# EAGLE design OpenQuadcopter (EAGLE 7.5.0)
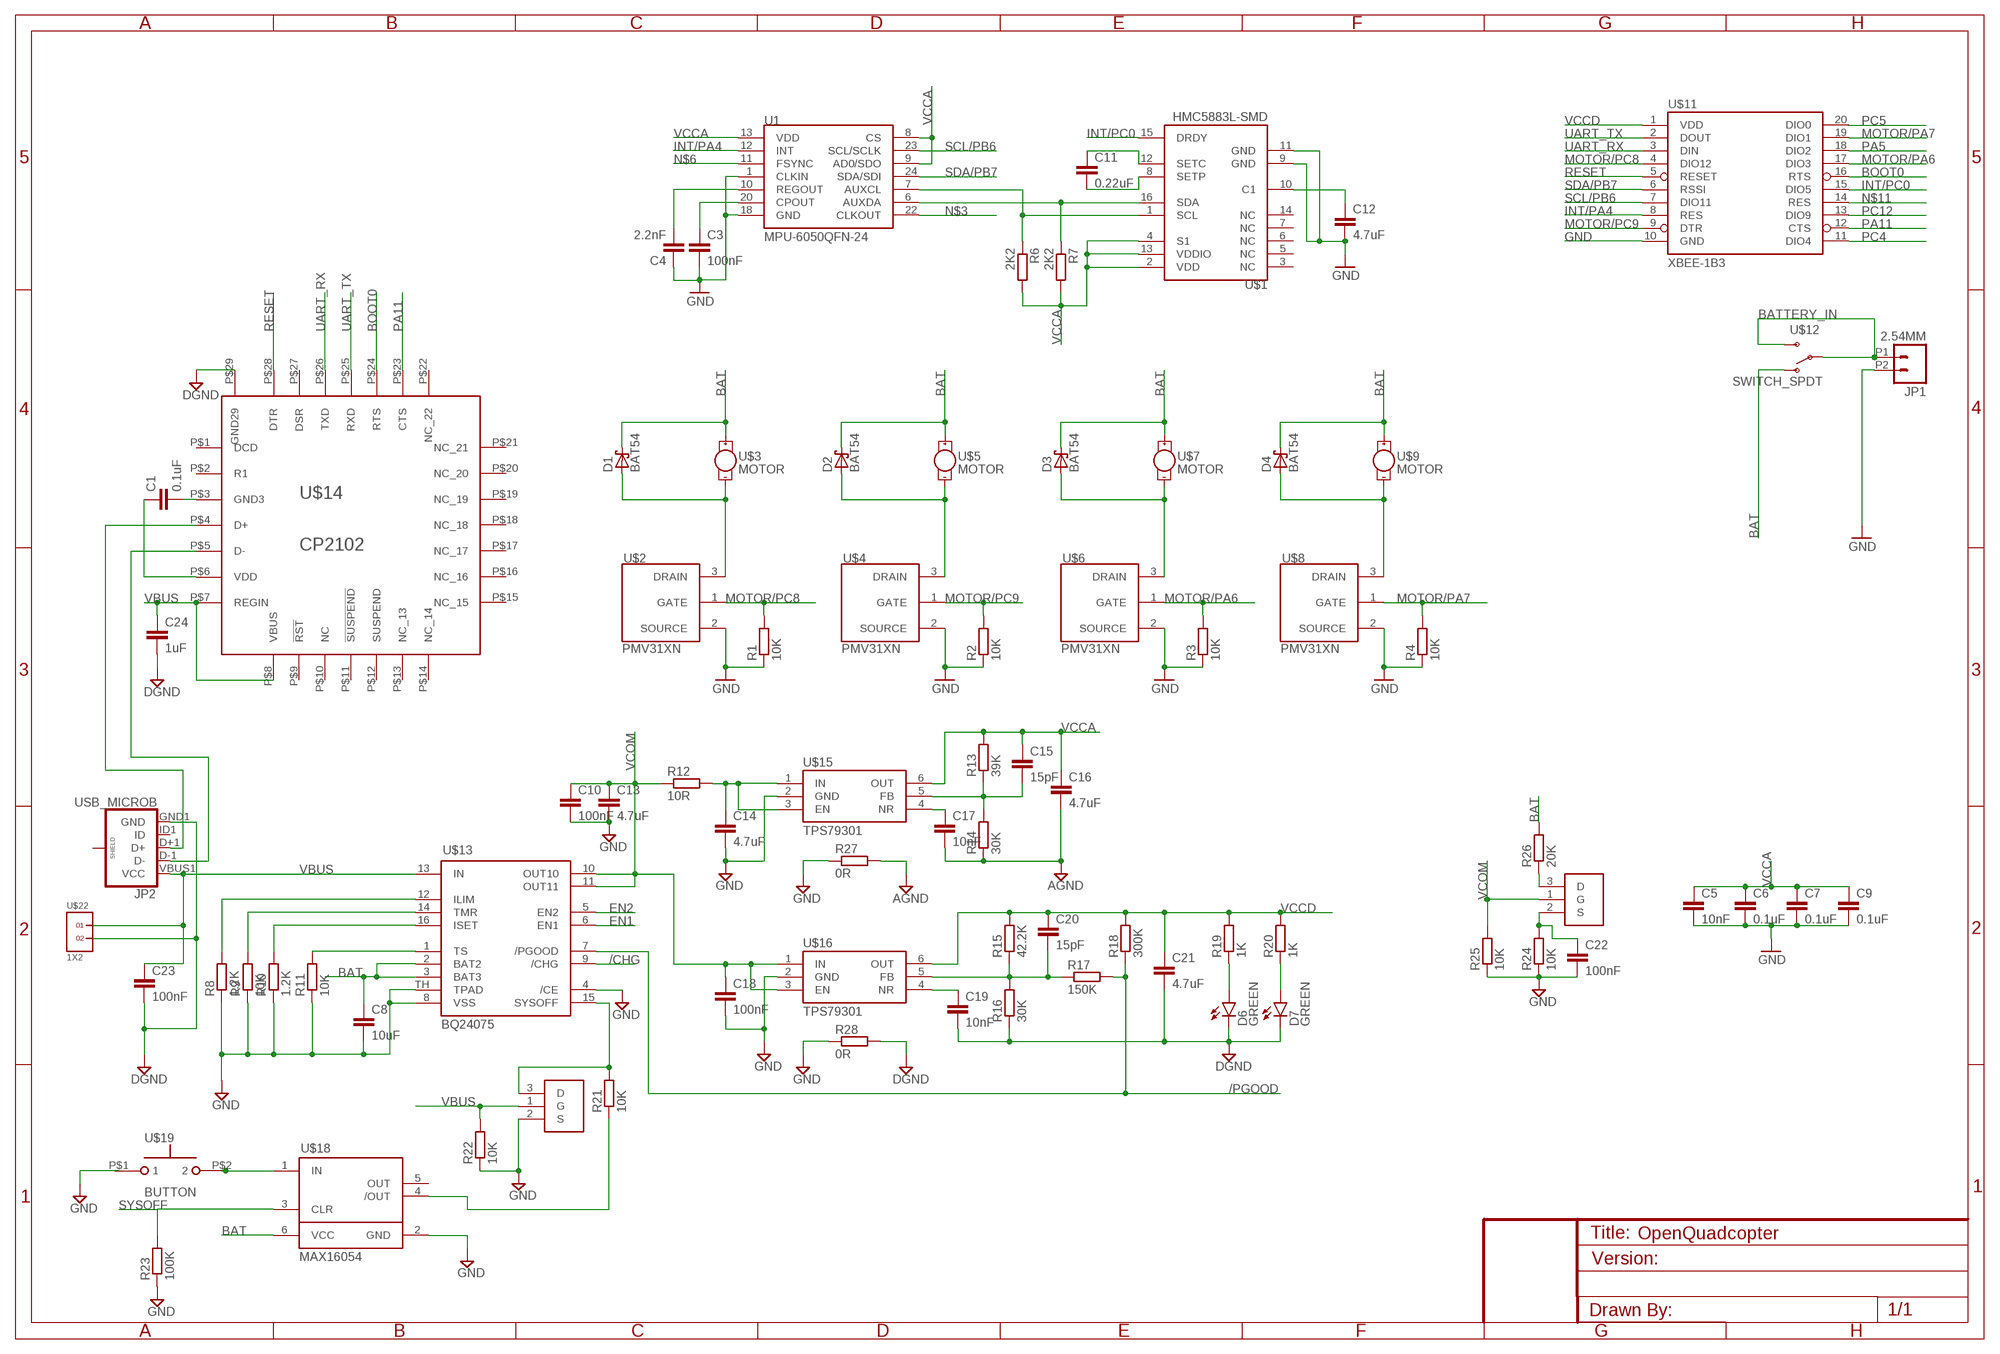
[diagram p0: schematic, sheet 1]

## Parts
C1  0.1uF  C-EUC0402  [C0402]
C3  100nF  C-EUC0402  [C0402]
C4  2.2nF  C-EUC0402  [C0402]
C5  10nF  C-EUC0402  [C0402]
C6  0.1uF  C-EUC0402  [C0402]
C7  0.1uF  C-EUC0402  [C0402]
C8  10uF  C-EUC0603  [C0603]
C9  0.1uF  C-EUC0402  [C0402]
C10  100nF  C-EUC0402  [C0402]
C11  0.22uF  C-EUC0402  [C0402]
C12  4.7uF  C-EUC0603  [C0603]
C13  4.7uF  C-EUC0603  [C0603]
C14  4.7uF  C-EUC0603  [C0603]
C15  15pF  C-EUC0402  [C0402]
C16  4.7uF  C-EUC0603  [C0603]
C17  10nF  C-EUC0402  [C0402]
C18  100nF  C-EUC0402  [C0402]
C19  10nF  C-EUC0402  [C0402]
C20  15pF  C-EUC0402  [C0402]
C21  4.7uF  C-EUC0603  [C0603]
C22  100nF  C-EUC0402  [C0402]
C23  100nF  C-EUC0402  [C0402]
C24  1uF  C-EUC0603  [C0603]
D1  BAT54  [SOT23]
D2  BAT54  [SOT23]
D3  BAT54  [SOT23]
D4  BAT54  [SOT23]
D6  GREEN  LED-GREEN0603  [LED-0603]
D7  GREEN  LED-GREEN0603  [LED-0603]
JP1  2.54MM  M022.54MM_SCREWTERM  [1X02_2.54_SCREWTERM]
JP2  USB_MICROB  USB_MICROB_PLUGCONN-11752  [USB-B-MICRO-SMD_V03]
R1  10K  R-EU_R0402  [R0402]
R2  10K  R-EU_R0402  [R0402]
R3  10K  R-EU_R0402  [R0402]
R4  10K  R-EU_R0402  [R0402]
R6  2K2  R-EU_R0402  [R0402]
R7  2K2  R-EU_R0402  [R0402]
R8  1.2K  R-EU_R0402  [R0402]
R9  10K  R-EU_R0402  [R0402]
R10  1.2K  R-EU_R0402  [R0402]
R11  10K  R-EU_R0402  [R0402]
R12  10R  R-EU_R0402  [R0402]
R13  39K  R-EU_R0402  [R0402]
R14  30K  R-EU_R0402  [R0402]
R15  42.2K  R-EU_R0402  [R0402]
R16  30K  R-EU_R0402  [R0402]
R17  150K  R-EU_R0402  [R0402]
R18  300K  R-EU_R0402  [R0402]
R19  1K  R-EU_R0402  [R0402]
R20  1K  R-EU_R0402  [R0402]
R21  10K  R-EU_R0402  [R0402]
R22  10K  R-EU_R0402  [R0402]
R23  100K  R-EU_R0402  [R0402]
R24  10K  R-EU_R0402  [R0402]
R25  10K  R-EU_R0402  [R0402]
R26  20K  R-EU_R0402  [R0402]
R27  0R  R-EU_R0402  [R0402]
R28  0R  R-EU_R0402  [R0402]
U1  MPU-6050QFN-24  MPU-6000QFN-24  [QFN-24-TESTING]
U$1  HMC5883L-SMD  HMC5883LSMD  [16LPCC]
U$2  PMV31XN  MOSFET  [SOT23-W]
U$3  MOTOR  MOTOR10MM  [VIBE-MOTOR-10MM]
U$4  PMV31XN  MOSFET  [SOT23-W]
U$5  MOTOR  MOTOR10MM  [VIBE-MOTOR-10MM]
U$6  PMV31XN  MOSFET  [SOT23-W]
U$7  MOTOR  MOTOR10MM  [VIBE-MOTOR-10MM]
U$8  PMV31XN  MOSFET  [SOT23-W]
U$9  MOTOR  MOTOR10MM  [VIBE-MOTOR-10MM]
U$11  XBEE-1B3  [XBEE-SMD]
U$12  SWITCH_SPDT  [KPS-1290]
U$13  BQ24075  [QFN16]
U$14  CP2102  [QFN28-5X5]
U$15  TPS79301  [SOT23-6]
U$16  TPS79301  [SOT23-6]
U$17  2N7002  [SOT23-3]
U$18  MAX16054  [SOT23-6]
U$19  BUTTON  [BUTTON]
U$20  2N7002  [SOT23-3]
U$22  1X2  [1X2]

## Nets
/CHG: U$13.9(/CHG)
/PGOOD: R17.2 R18.1 U$13.7(/PGOOD)
AGND: C16.2 C17.2 R14.1 R27.2
BAT: C8.1 D1.3(C) D2.3(C) D3.3(C) D4.3(C) R26.2 U$3.+ U$5.+ U$7.+ U$9.+ U$12.O U$13.2(BAT2) U$13.3(BAT3) U$18.6(VCC)
BATTERY_IN: JP1.P1 U$12.P U$12.S
BOOT0: U$11.16(RTS) U$14.P$24(RTS)
DGND: C19.2 C21.2 C23.2 C24.2 D6.C D7.C JP2.GND1(GND) R16.1 R28.2 U$14.P$29(GND29) U$22.2
EN1: U$13.6(EN1)
EN2: U$13.5(EN2)
GND: C3.2 C4.1 C5.2 C6.2 C7.2 C8.2 C9.2 C10.2 C12.2 C13.2 C14.2 C18.2 C22.2 JP1.P2 R1.1 R2.1 R3.1 R4.1 R8.1 R9.1 R10.1 R11.1 R22.1 R23.1 R24.1 R25.1 R27.1 R28.1 U1.1(CLKIN) U1.18(GND) U$1.9(GND) U$1.11(GND) U$2.2(SOURCE) U$4.2(SOURCE) U$6.2(SOURCE) U$8.2(SOURCE) U$11.10(GND) U$13.4(/CE) U$13.8(VSS) U$13.TH(TPAD) U$15.2(GND) U$16.2(GND) U$17.2(S) U$18.2(GND)
INT/PA4: U1.12(INT) U$11.8(RES)
INT/PC0: U$1.15(DRDY) U$11.15(DIO5)
MOTOR/PA6: R3.2 U$6.1(GATE) U$11.17(DIO3)
MOTOR/PA7: R4.2 U$8.1(GATE) U$11.19(DIO1)
MOTOR/PC8: R1.2 U$2.1(GATE) U$11.4(DIO12)
MOTOR/PC9: R2.2 U$4.1(GATE) U$11.9(DTR)
N$1: D2.1(A) U$4.3(DRAIN) U$5.-
N$2: D1.1(A) U$2.3(DRAIN) U$3.-
N$3: U1.22(CLKOUT)
N$4: R6.1 U1.7(AUXCL) U$1.1(SCL)
N$5: D3.1(A) U$6.3(DRAIN) U$7.-
N$6: U1.11(FSYNC)
N$7: D4.1(A) U$8.3(DRAIN) U$9.-
N$8: R7.1 U1.6(AUXDA) U$1.16(SDA)
N$9: C4.2 U1.10(REGOUT)
N$10: C1.2 U$14.P$3(GND3)
N$11: U$11.14(RES)
N$12: C3.1 U1.20(CPOUT)
N$13: C11.1 U$1.12(SETC)
N$14: C11.2 U$1.8(SETP)
N$15: R21.1 U$18.4(/OUT)
N$16: C12.1 U$1.10(C1)
N$17: C1.1 U$14.P$6(VDD)
N$18: R8.2 U$13.12(ILIM)
N$19: R9.2 U$13.14(TMR)
N$20: R10.2 U$13.16(ISET)
N$21: R11.2 U$13.1(TS)
N$23: R21.2 U$13.15(SYSOFF) U$17.3(D)
N$24: C14.1 R12.2 U$15.1(IN) U$15.3(EN)
N$25: U$18.1(IN) U$19.P$2
N$26: C15.2 R13.1 R14.2 U$15.5(FB)
N$27: C17.1 U$15.4(NR)
N$28: C19.1 U$16.4(NR)
N$29: C20.2 R15.1 R16.2 R17.1 U$16.5(FB)
N$30: C22.1 R24.2 U$20.2(S)
N$32: D6.A R19.1
N$33: D7.A R20.1
N$34: R26.1 U$20.3(D)
N$35: JP2.D+1(D+) U$14.P$4(D+)
N$36: JP2.D-1(D-) U$14.P$5(D-)
PA5: U$11.18(DIO2)
PA11: U$11.12(CTS) U$14.P$23(CTS)
PC4: U$11.11(DIO4)
PC5: U$11.20(DIO0)
PC12: U$11.13(DIO9)
RESET: U$11.5(RESET) U$14.P$28(DTR)
SCL/PB6: U1.23(SCL/SCLK) U$11.7(DIO11)
SDA/PB7: U1.24(SDA/SDI) U$11.6(RSSI)
SYSOFF: R23.2 U$18.3(CLR)
UART_RX: U$11.3(DIN) U$14.P$26(TXD)
UART_TX: U$11.2(DOUT) U$14.P$25(RXD)
VBUS: C23.1 C24.1 JP2.VBUS1(VCC) R22.2 U$13.13(IN) U$14.P$7(REGIN) U$14.P$8(VBUS) U$17.1(G) U$22.1
VCCA: C5.1 C6.1 C7.1 C9.1 C15.1 C16.1 R6.2 R7.2 R13.2 U1.8(CS) U1.9(AD0/SDO) U1.13(VDD) U$1.2(VDD) U$1.4(S1) U$1.13(VDDIO) U$15.6(OUT)
VCCD: C20.1 C21.1 R15.2 R18.2 R19.2 R20.2 U$11.1(VDD) U$16.6(OUT)
VCOM: C10.1 C13.1 C18.1 R12.1 R25.2 U$13.10(OUT10) U$13.11(OUT11) U$16.1(IN) U$16.3(EN) U$20.1(G)
Unconnected: JP2.ID1(ID) JP2.SHIELD1(SHIELD) JP2.SHIELD2(SHIELD) JP2.SHIELD3(SHIELD) U$1.3(NC) U$1.5(NC) U$1.6(NC) U$1.7(NC) U$1.14(NC) U$14.P$1(DCD) U$14.P$2(R1) U$14.P$9(!RST) U$14.P$10(NC) U$14.P$11(!SUSPEND) U$14.P$12(SUSPEND) U$14.P$13(NC_13) U$14.P$14(NC_14) U$14.P$15(NC_15) U$14.P$16(NC_16) U$14.P$17(NC_17) U$14.P$18(NC_18) U$14.P$19(NC_19) U$14.P$20(NC_20) U$14.P$21(NC_21) U$14.P$22(NC_22) U$14.P$27(DSR) U$18.5(OUT) U$19.P$1

## Library data of the parts
C1 C8 C10 C13-C24 = openmotestm:C-EU: CAPACITOR, European symbol
C3-C7 C9 C11 C12 = rcl:C-EU: CAPACITOR, European symbol
D1-D4 = diode:BAT54: Schottky Diodes Source: Fairchild .. BAT54.pdf
D6 D7 = openmotestm:LED-GREEN: Various green LEDs Green LEDs used in SFE Production 0603- DIO-00821 LARGE- DIO-00862 LILYPAD- DIO-09910; PROD_ID: DIO-00821
JP1 = SparkFun-Connectors:M02: Standard 2-pin 0.1" header. Use with - straight break away headers ( PRT-00116) - right angle break away headers (PRT-00553) - swiss pins (PRT-00743) - machine pins (PRT-00117) - female headers (PRT-00115) Molex polarized connector foot print use with: PRT-08233 with associated crimp pins and housings. 2.54_SCREWTERM for use with PRT-10571. 3.5mm Screw Terminal footprints for PRT-08084 5mm Screw Terminal footprints for use with PRT-08432
JP2 = openmotestm:USB_MICROB_PLUG: USB Micro-B connectors Some male, some female. Watch your step!; PROD_ID: CONN-11752
R1-R4 R6 R7 = rcl:R-EU_: RESISTOR, European symbol
R8-R28 = openmotestm:R-EU_: RESISTOR, European symbol
U1 = openmotestm:MPU-6000: MPU-6000/6050 - I2C address is 0x68 with AD0 low and 0x69 with AD0 high.
U$1 = openmotestm:HMC5883L: 3 Axis Digital Compass IC
U$2 U$4 U$6 U$8 = openmotestm:MOSFET
U$3 U$5 U$7 U$9 = openmotestm:MOTOR: Vibration Motor- ROB-08449 Physical dimension and wire connections for this powerful vibration motor. Motor has a self adhesive backing.
U$11 = openmotestm:XBEE-1: Xbee module footprints SMT header is CONN-09042.; PROD_ID: CONN-09042
U$12 = openmotestm:SWITCH_SPDT: SWCH-10651 Side-actuated SPDT slide switch, as used on the Arduino Pro; PROD_ID: SWCH-10651
U$13 = openmotestm:BQ24075
U$14 = openmotestm:CP2102: silicon lab cp2102 signal chip usb to uart bridge
U$15 U$16 = openmotestm:TPS79301
U$17 U$20 = openmotestm:2N7002
U$18 = openmotestm:MAX16054
U$19 = openmotestm:BUTTON: TL1015AF160QG http://spec_sheets.e-switch.com/specs/P420000.pdf
U$22 = openmotestm:1X2

## Board
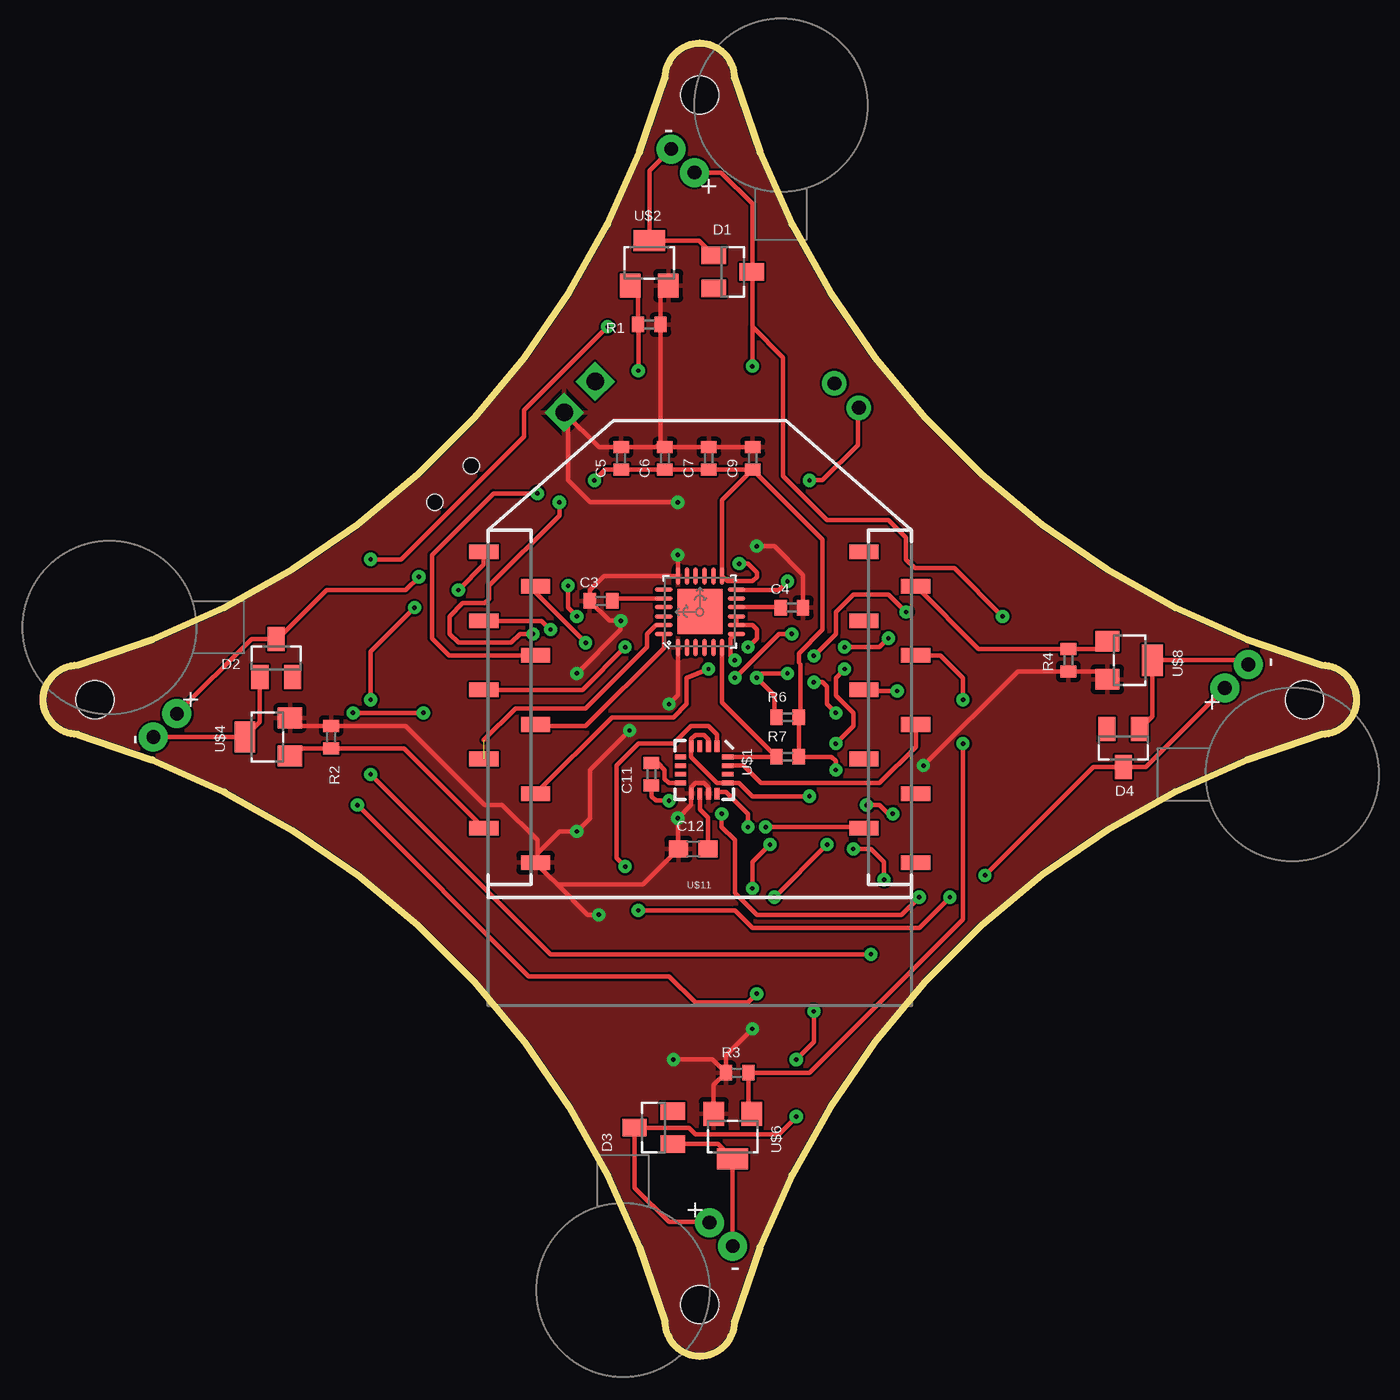
[diagram p1: board, top side]
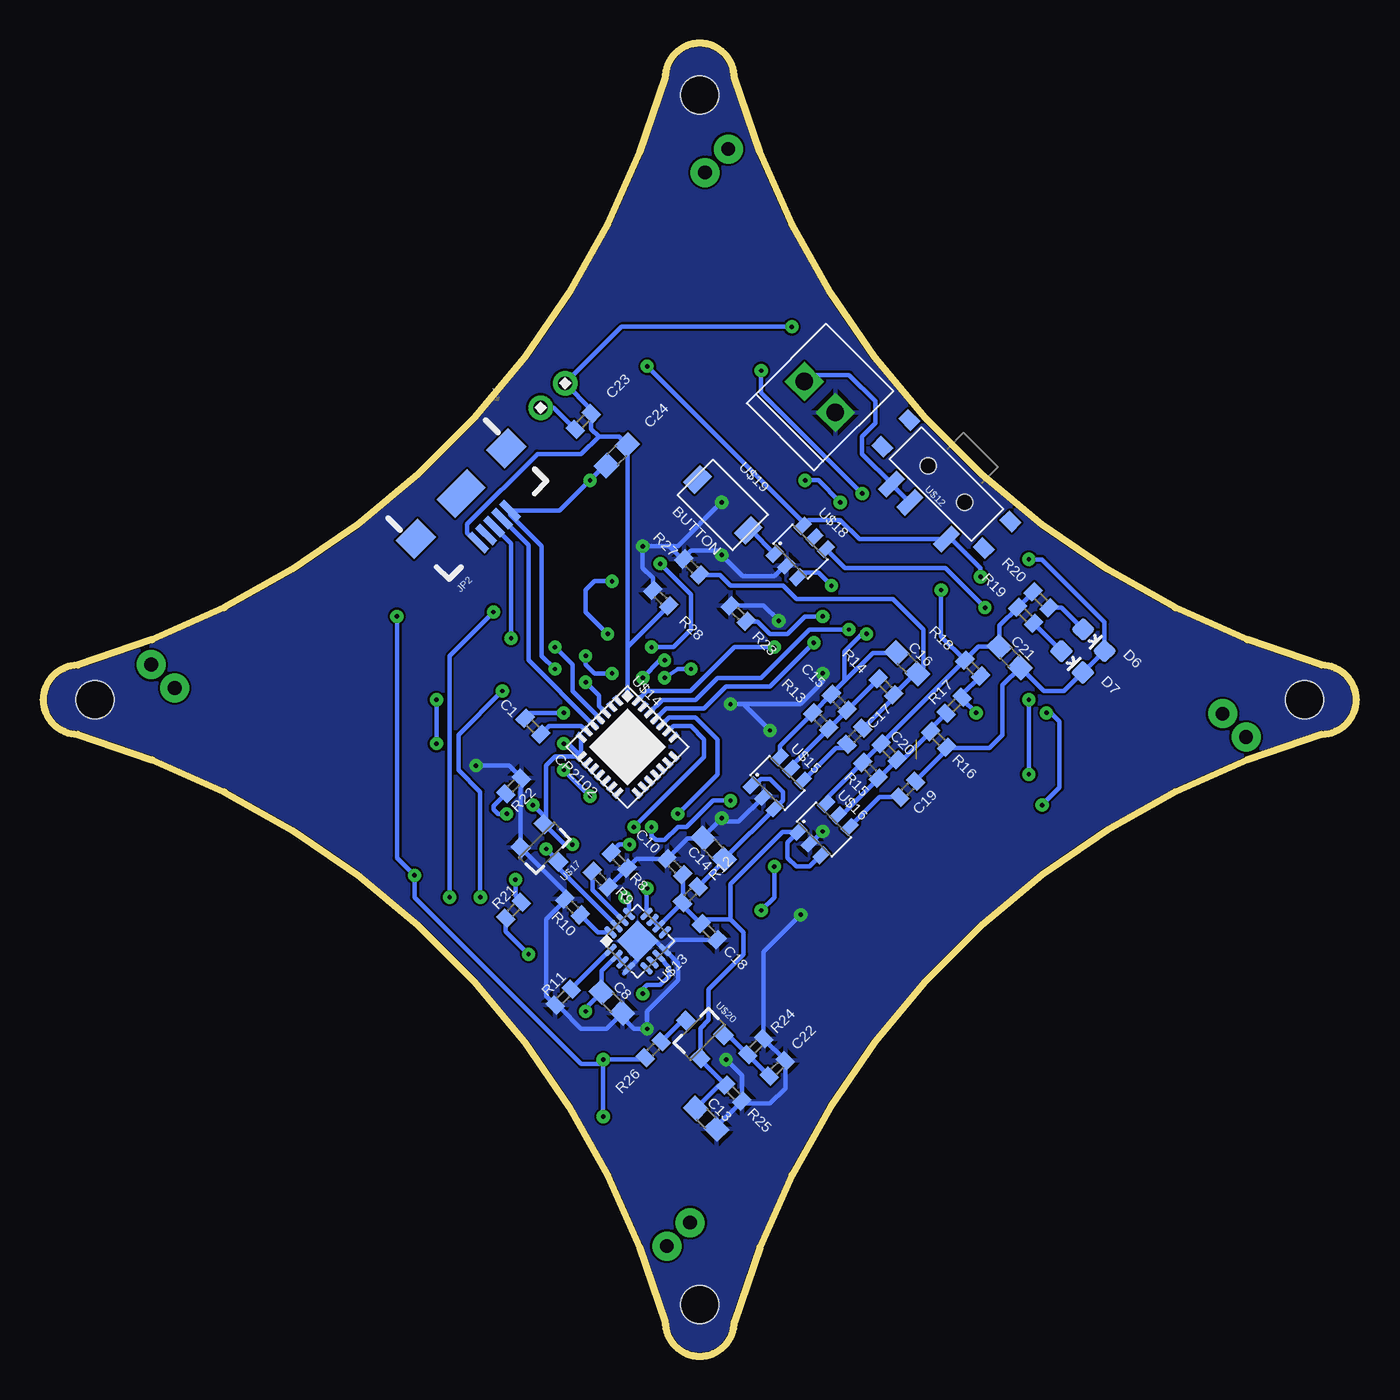
[diagram p2: board, bottom side, seen from below]

Size 76 x 76 mm. Coordinates in mm from the lower left corner, seen from the top.
Outline: 2,36 arc-57 36,2 arc180 40,2 arc-57 74,36 arc180 74,40 arc-57 40,74 arc180 36,74 arc-57 2,40 arc180 2,36
Copper layers (1*16): Top 0.035mm / dielectric 1.5mm / Bottom 0.035mm
Design rules "SparkFun *": minimum track width 8mil, minimum drill 10mil, track to track 5mil, track to pad 5mil, pad to pad 5mil, via to via 5mil, smd to smd 5mil, copper to edge 1mil, drill to drill 8mil, minimum pad ring 12mil, minimum via ring 10mil, stop-mask expansion 4mil, vias tented up to drill 20mil, thermal gap 10mil
Holes 2.2 mm at 38,73 3,38 38,3 73,38

### Footprints (pad centres in the part's own frame; a part is rotated, then mirrored left to right if it is on the bottom)
C0402 = smd 0.7 x 0.9: 1 -0.65,0; 2 0.65,0
C0603 = smd 1.1 x 1: 1 -0.85,0; 2 0.85,0
SOT23 = smd 1 x 1.4: 1 -0.95,-1.1; 2 0.95,-1.1; 3 0,1.1
LED-0603 = smd 1 x 1: A 0,-0.877; C 0,0.877
1X02_2.54_SCREWTERM = drill 1.016 square: P1 2.54,0; P2 0,0
USB-B-MICRO-SMD_V03 = smd 1.4 x 0.4: D+1 2.7,0; D-1 2.7,0.65; GND1 2.7,-1.3; ID1 2.7,-0.65; VBUS1 2.7,1.3 | smd 1.5 x 1.8: SHIELD1 0,3.7; SHIELD2 0,-3.7 | smd 1.5 x 2.5: SHIELD3 0,0
R0402 = smd 0.7 x 0.9: 1 -0.65,0; 2 0.65,0
QFN-24-TESTING = smd 1.016 x 0.254: 1 -2.066,1.257; 2 -2.066,0.75; 3 -2.066,0.247; 4 -2.066,-0.287; 5 -2.066,-0.792; 6 -2.066,-1.297; 13 2.086,-1.297; 14 2.086,-0.792; 15 2.086,-0.287; 16 2.086,0.247; 17 2.086,0.75; 18 2.086,1.257 | smd 0.254 x 1.016: 7 -1.267,-2.122; 8 -0.762,-2.122; 9 -0.258,-2.122; 10 0.278,-2.122; 11 0.78,-2.122; 12 1.287,-2.122; 19 1.287,2.082; 20 0.78,2.082; 21 0.278,2.082; 22 -0.258,2.082; 23 -0.762,2.082; 24 -1.267,2.082 | smd 2.616 x 2.616: P$1 0.02,-0.01
16LPCC = smd 0.65 x 0.28: 1 -1.37,0.75; 2 -1.37,0.25; 3 -1.37,-0.25; 4 -1.37,-0.75; 9 1.37,-0.75; 10 1.37,-0.25; 11 1.37,0.25; 12 1.37,0.75 | smd 0.28 x 0.65: 5 -0.75,-1.37; 6 -0.25,-1.37; 7 0.25,-1.37; 8 0.75,-1.37; 13 0.75,1.37; 14 0.25,1.37; 15 -0.25,1.37; 16 -0.75,1.37
SOT23-W = smd 1.2 x 1.4: 1 -1.1,-1.3; 2 1.1,-1.3 | smd 1.8 x 1.2: 3 0,1.3
VIBE-MOTOR-10MM = drill 0.8 pad 1.676: + -5,-3.9; - -6.35,-2.54
XBEE-SMD = smd 1.7 x 0.85: 1 -12.5,20; 2 -9.5,18; 3 -12.5,16; 4 -9.5,14; 5 -12.5,12; 6 -9.5,10; 7 -12.5,8; 8 -9.5,6; 9 -12.5,4; 10 -9.5,2; 11 12.5,2; 12 9.5,4; 13 12.5,6; 14 9.5,8; 15 12.5,10; 16 9.5,12; 17 12.5,14; 18 9.5,16; 19 12.5,18; 20 9.5,20
KPS-1290 = smd 0.7 x 1.5: O -2.25,2.25; P 0.75,2.25; S 2.25,2.25 | smd 1 x 0.8: P$1 -4.15,1.1; P$2 -4.15,-1.1; P$3 4.15,-1.1; P$4 4.15,1.1 | hole 0.9: -1.5,0; 1.5,0
QFN16 = smd 0.85 x 0.3: 1 -1.475,0.75; 2 -1.475,0.25; 3 -1.475,-0.25; 4 -1.475,-0.75; 9 1.475,-0.75; 10 1.475,-0.25; 11 1.475,0.25; 12 1.475,0.75 | smd 0.3 x 0.85: 5 -0.75,-1.475; 6 -0.25,-1.475; 7 0.25,-1.475; 8 0.75,-1.475; 13 0.75,1.475; 14 0.25,1.475; 15 -0.25,1.475; 16 -0.75,1.475 | smd 1.7 x 1.7: TH 0,0
QFN28-5X5 = smd 0.6 x 0.3: P$1 -2.3,1.5; P$2 -2.3,1; P$3 -2.3,0.5; P$4 -2.3,0; P$5 -2.3,-0.5; P$6 -2.3,-1; P$7 -2.3,-1.5; P$15 2.3,-1.5; P$16 2.3,-1; P$17 2.3,-0.5; P$18 2.3,0; P$19 2.3,0.5; P$20 2.3,1; P$21 2.3,1.5 | smd 0.3 x 0.6: P$8 -1.5,-2.3; P$9 -1,-2.3; P$10 -0.5,-2.3; P$11 0,-2.3; P$12 0.5,-2.3; P$13 1,-2.3; P$14 1.5,-2.3; P$22 1.5,2.3; P$23 1,2.3; P$24 0.5,2.3; P$25 0,2.3; P$26 -0.5,2.3; P$27 -1,2.3; P$28 -1.5,2.3 | smd 0.5 x 0.5: P$29 -2.103,2.103
SOT23-6 = smd 0.6 x 0.9: 1 -0.95,-1.15; 2 0,-1.15; 3 0.95,-1.15; 4 0.95,1.15; 5 0,1.15; 6 -0.95,1.15
SOT23-3 = smd 0.8 x 0.9: 1 -0.95,-1; 2 0.95,-1; 3 0,1.1
BUTTON = smd 0.95 x 1.4: P$1 -2.075,0; P$2 2.075,0
1X2 = drill 0.8 pad 1.422: 1 -1,0; 2 1,0

### Placement (x,y rotation side)
C1  47.65,36.48 135 bottom
C3  32.28,43.72 180 top
C4  43.33,43.33 180 top
C5  33.45,51.97 90 top
C6  35.99,51.97 90 top
C7  38.53,51.97 90 top
C8  43.08,20.47 315 bottom
C9  41.07,51.97 90 top
C10  39.44,28.34 135 bottom
C11  35.21,33.68 90 top
C12  37.62,29.36 180 top
C13  37.63,13.75 315 bottom
C14  37.2,29.38 135 bottom
C15  29.92,37.86 315 bottom
C16  26,40.11 315 bottom
C17  29.02,35.88 45 bottom
C18  37.46,24.57 315 bottom
C19  25.97,32.83 45 bottom
C20  27.04,34.99 315 bottom
C21  20.06,40.47 315 bottom
C22  33.51,16.67 45 bottom
C23  44.74,54.1 45 bottom
C24  42.79,52.15 45 bottom
D1  39.91,62.77 270 top
D2  13.49,40.41 0 top
D3  35.33,13.23 90 top
D4  62.51,35.21 180 top
D6  16.45,40.19 225 bottom
D7  15.19,41.45 225 bottom
JP1  30.15,54.63 135 bottom
JP2  51.81,49.94 315 bottom
R1  35.08,59.72 180 top
R2  16.66,35.84 270 top
R3  40.16,16.41 0 top
R4  59.34,40.29 90 top
R6  43.08,36.98 0 top
R7  43.08,34.7 0 top
R8  42.67,28.7 135 bottom
R9  43.75,27.62 135 bottom
R10  45.36,26.01 315 bottom
R11  45.9,20.8 45 bottom
R12  38.54,26.72 45 bottom
R13  31,36.78 135 bottom
R14  27.22,38.76 135 bottom
R15  28.12,33.91 135 bottom
R16  24.17,35.7 135 bottom
R17  23.27,37.68 45 bottom
R18  22.19,39.84 135 bottom
R19  19.14,42.89 135 bottom
R20  18.24,43.79 135 bottom
R21  48.78,25.83 45 bottom
R22  48.78,33.01 225 bottom
R23  35.77,42.99 315 bottom
R24  34.77,17.92 225 bottom
R25  36.02,15.23 135 bottom
R26  40.69,17.74 225 bottom
R27  38.46,45.68 315 bottom
R28  40.26,43.89 315 bottom
U1  38,43.08 90 top
U$1  38.25,33.94 270 top
U$2  35.08,63.27 0 top
U$3  42.7,72.42 0 top
U$4  12.98,35.84 90 top
U$5  3.84,42.19 90 top
U$6  39.91,12.73 180 top
U$7  33.55,3.84 180 top
U$8  62.89,40.29 270 top
U$9  72.29,33.68 270 top
U$11  38,26.57 0 top
U$12  23.72,50.48 135 bottom
U$13  41.59,24.03 45 bottom
U$14  42.18,35.27 315 bottom
U$15  33.51,33.19 315 bottom
U$16  30.82,30.5 315 bottom
U$17  46.98,29.42 225 bottom
U$18  32.18,46.58 315 bottom
U$19  36.67,49.28 315 bottom
U$20  38,18.64 45 bottom
U$22  46.5,55.61 45 bottom

### Tracks (layer width: path | path; a pad name or v marks a point on that pad's centre or on a via)
/PGOOD  (via drill 0.25)
  Top 0.254: v22,37.24 v17.93,37.24 | v18.19,31.9 28.09,22 36.22,22 37.75,20.47 40.79,20.47 v41.3,20.98
  Bottom 0.254: v22,37.24 22.81,38.05 R17.2 22.81,38.3 R18.1 | v17.93,37.24 17.68,37.24 17.17,36.73 17.17,32.92 v18.19,31.9 | v41.3,20.98 41.3,21.24 41.05,21.49 40.29,21.49 39.78,22 39.78,22.51 40.03,22.76 40.03,22.82 U$13.7
AGND
  Bottom 0.254: C17.2 26.76,38.14 R14.1 25.55,39.51 C16.2 25.05,39.86 25.05,42.06 26.32,43.33 | R27.2 36.84,45.22 36.22,44.6 33.17,44.6 32.41,43.84 26.82,43.84 26.32,43.33 | 26.32,43.34 26.32,43.33
BAT  (via drill 0.25, 0.25 pad 0.25)
  Top 0.254: v44.6,19.97 44.6,18.19 v43.59,17.17 | U$5.+ 12.06,41.51 D2.3 13.57,41.51 16.41,44.35 20.98,44.35 v21.74,45.11 | v54.51,27.84 60.78,34.11 D4.3 63.81,34.11 U$9.+ | U$3.+ 39.23,68.52 41.05,66.7 41.05,62.81 D1.3 41.05,62.72 41.05,59.59 | U$7.+ 38.52,7.77 36.22,7.77 34.23,9.76 D3.3 37.37,13.23 37.75,12.85 42.57,12.85 v43.59,13.87 | 41.05,59.59 42.83,57.81 42.83,50.95 45.37,48.41 48.92,48.41 49.94,47.4 49.94,46.13 50.45,45.62 52.73,45.62 v55.53,42.83 | v41.05,57.3 41.05,59.59
  Bottom 0.254: U$13.2 U$13.3 | 42.8,23.18 U$13.2 | v44.6,19.97 44.58,19.99 44.58,20.18 C8.1 43.68,22.3 U$13.2 | v43.59,17.17 41.27,17.17 R26.2 | v43.59,17.17 43.84,16.92 44.86,16.92 54.51,26.57 v54.51,27.84 55.53,28.86 v55.53,42.83 | 21.74,45.58 v21.74,45.11 21.74,45.62 23.42,47.3 U$12.O 28.76,47.3 29.87,48.41 31.69,48.41 U$18.6 32.03,48.29 v41.05,57.3 | v43.59,13.87 v43.59,17.17
BATTERY_IN
  Bottom 0.254: U$12.P 25.59,49.42 U$12.P | JP1.P1 31.58,56.8 29.36,56.8 27.84,55.27 27.84,54 28.6,53.24 28.6,52.22 26.86,50.48 U$12.S U$12.P
BOOT0  (via drill 0.25 pad 0.25)
  Top 0.254: v39.27,31.4 39.27,30.63 40.03,29.87 40.03,26.82 41.3,25.55 49.68,25.55 v50.7,26.57 | v49.43,38.51 47.56,38.51 U$11.16
  Bottom 0.254: U$14.P$24 40.2,36.56 39.78,36.98 38.25,36.98 36.98,35.71 36.98,33.68 v39.27,31.4 | v50.7,26.57 50.7,32.67 51.97,33.94 51.97,35.97 v49.43,38.51
DGND  (via drill 0.25)
  Top 0.254: v18.95,46.13 20.73,46.13 27.84,53.24 27.84,54.76 v32.67,59.59
  Bottom 0.254: JP2.GND1 50.92,47.11 51.46,47.65 51.46,48.16 47.4,52.22 44.86,52.22 43.84,53.24 | 43.84,53.24 42.68,53.24 C24.2 U$14.P$29 42.18,41.05 R28.2 | 43.84,53.24 44.28,53.68 C23.2 44.28,54.8 U$22.2 42.52,59.59 v32.67,59.59 | D7.C | D6.C 15.86,39.57 15.86,39.56 16.92,38.51 18.1,38.51 C21.2 20.48,38.84 20.48,35.96 21.24,35.21 23.67,35.21 R16.1 23.71,35.09 C19.2 | D7.C 14.57,42.51 18.19,46.13 v18.95,46.13 | D6.C | D6.C D7.C
GND  (via drill 0.25, 0.25 pad 0.25)
  Top 0.254: U$6.2 38.8,15.71 R3.1 | R3.1 39.51,17.41 v41.05,18.95 | U$1.11 38.5,32.92 38.25,33.17 37.75,33.17 37.5,32.93 U$1.9 37.5,31.92 v36.73,31.14 | 28.6,29.11 28.6,29.87 26.57,31.9 25.55,31.9 20.97,36.49 R2.1 14.73,36.49 U$4.2 | 28.6,29.11 28.6,28.67 U$11.10 29.17,27.9 29.77,27.3 | U$8.2 61.14,39.64 R4.1 56.4,39.64 v50.95,34.19 | 35.46,52.62 C5.2 32.16,52.62 JP1.P2 30.38,54.4 30.38,50.7 31.65,49.43 v36.73,49.43 | 35.46,52.62 C6.2 C7.2 C9.2 | U$2.2 35.73,61.52 R1.1 35.73,52.89 35.46,52.62 | v36.73,46.38 U1.18 32.47,45.17 31.65,44.35 31.65,43.73 C3.2 32.78,42.57 v33.43,42.57 33.43,42.06 v30.89,39.52 | C4.1 43.98,45.22 42.32,46.89 v41.3,46.89 | 28.6,29.11 29.87,30.38 v30.89,30.38 31.65,31.14 31.65,33.94 v33.94,36.22 | v36.73,31.14 36.73,30.11 36.74,30.1 36.74,29.39 C12.2 34.7,27.3 29.77,27.3 | 36.74,31.15 v36.73,31.14 | v36.48,17.17 38.75,17.17 R3.1 | U1.1 36.74,38.27 v36.22,37.75 | v32.16,25.55 31.52,25.55 29.77,27.3
  Bottom 0.254: 42.39,22.17 U$13.4 41.59,22.97 U$13.TH 41.34,24.28 40.79,24.28 U$13.8 | R24.1 | C22.2 33.05,15.52 33.94,14.63 35.43,14.63 R25.1 | C18.2 39.43,24.11 U$13.8 | U$13.8 39.27,22.77 39.27,21.74 41.05,19.97 v41.05,18.95 41.81,18.95 42.48,19.62 C8.2 43.4,18.95 44.86,18.95 46.07,20.16 46.18,20.16 R11.1 46.89,20.86 46.89,25.3 45.82,26.37 R10.1 45.82,26.92 U$17.2 48.36,33.43 R22.1 49.04,34.19 v50.95,34.19 | R9.1 R8.1 41.65,28.8 C10.2 | C10.2 | U$15.2 35.74,30.95 36.54,30.95 v36.73,31.14 | U$18.2 33.08,45.77 33.68,45.17 35.51,45.17 v36.73,46.38 36.98,46.64 38.51,46.64 38.92,46.22 R27.1 39.03,46.14 39.78,46.89 v41.3,46.89 | R28.1 40.72,45.04 41.3,45.62 v41.3,46.89 | U$16.2 31.59,29.68 v30.89,30.38 | 36.65,31.22 v36.73,31.14 | R25.1 35.56,16.26 v36.48,17.17 | R23.1 34.3,43.45 v33.43,42.57 | v30.89,39.52 30.89,39.02 32.16,37.75 v36.22,37.75 35.46,37.75 v33.94,36.22 | v41.3,46.89 39.27,46.89 v36.73,49.43 | C13.2 37.03,13.31 R25.1 | C10.2 38.71,29.98 C14.2 37.8,30.07 v36.73,31.14 | R24.1 34.31,23.41 v32.16,25.55 | C22.2 | C22.2 R24.1
  pour Top: -12,38 arc90 38,88 arc90 88,38 arc90 38,-12 arc90
  pour Bottom: -12,38 arc90 38,88 arc90 88,38 arc90 38,-12 arc90
INT/PA4  (via drill 0.25 pad 0.25)
  Top 0.254: U$11.8 32.92,36.98 36.48,36.98 37.24,37.75 37.24,39.27 v38.51,39.78 | U1.12 40.14,44.35 42.57,44.35 v43.08,44.86 | v43.33,41.81 42.57,41.81 v40.03,39.27
  Bottom 0.254: v43.08,44.86 44.1,44.86 44.6,44.35 44.6,43.08 v43.33,41.81 | v40.03,39.27 39.27,39.78 v38.51,39.78
INT/PC0
  Top 0.254: U$11.15 50.5,35.26 48.41,33.17 41.56,33.17 40.54,34.19 U$1.15
MOTOR/PA6  (via drill 0.25 pad 0.25)
  Top 0.254: U$11.17 51.94,40.57 53.24,39.27 v53.24,38 | v53.24,35.46 53.24,25.3 44.35,16.41 R3.2 40.81,14.22 U$6.1
  Bottom 0.254: v53.24,38 v53.24,35.46
MOTOR/PA7
  Top 0.254: U$11.19 54.13,40.94 R4.2 61.14,40.94 U$8.1
MOTOR/PC8  (via drill 0.25)
  Top 0.254: U$2.1 34.43,61.52 R1.2 34.44,59.7 v34.44,57.05 | U$11.4 23.49,40.57 22.51,41.56 22.51,46.38 26.06,49.94 v28.6,49.94
  Bottom 0.254: v28.6,49.94 34.44,55.78 v34.44,57.05
MOTOR/PC9
  Top 0.254: U$11.9 20.88,35.19 R2.2 14.73,35.19 U$4.1
N$1
  Top 0.254: U$5.- U$4.3 12.54,36.7 D2.1
N$2
  Top 0.254: D1.1 37.95,64.57 U$2.3 35.08,68.61 U$3.-
N$4  (via drill 0.25, 0.25 pad 0.25)
  Top 0.254: U1.7 40.03,41.81 39.78,41.56 39.78,40.54 v40.03,40.29 | R6.1 42.32,37.1 42.32,38.25 v41.3,39.27 41.56,39.52 v43.08,39.52 | U$1.1 39,35.98 38.51,36.48 37.49,36.48 36.48,35.46 34.44,35.46 33.17,34.19 33.17,28.86 v33.68,28.35 | v34.44,25.81 40.03,25.81 41.05,24.79 50.7,24.79 v52.48,26.57 | v49.94,43.08 48.92,44.1 46.89,44.1 45.87,43.08 45.87,41.81 v44.6,40.54
  Bottom 0.254: v40.03,40.29 40.29,40.29 v41.3,39.27 | v33.68,28.35 33.68,26.57 v34.44,25.81 | v52.48,26.57 52.48,40.54 v49.94,43.08 | v44.6,40.54 44.6,40.03 44.1,39.52 v43.08,39.52
N$5
  Top 0.254: U$7.- U$6.3 39.05,12.29 D3.1
N$7
  Top 0.254: D4.1 64.19,37.04 U$8.3 69.5,40.29 U$9.-
N$8
  Top 0.254: U$1.16 39.64,34.7 R7.1 39.3,37.83 U1.6
N$9
  Top 0.254: U1.10 42.66,43.36 C4.2
N$10  (via drill 0.25 pad 0.25)
  Top 0.254: v44.6,39.02 45.11,39.02 45.37,38.76 45.37,37.75 v45.87,37.24
  Bottom 0.254: U$14.P$3 43.84,37.64 43.84,38.25 v44.6,39.02 | v45.87,37.24 47.81,37.24 C1.2
N$12
  Top 0.254: U1.20 33.08,43.86 C3.1
N$13  (via drill 0.25 pad 0.25)
  Top 0.254: C11.1 35.21,32.41 35.46,32.16 v36.22,32.16 | U$1.12 39.1,32.67 39.52,32.67 40.79,31.4 v40.79,30.63
  Bottom 0.254: v40.79,30.63 40.79,30.13 40.54,29.87 40.03,29.87 39.27,30.63 38.76,30.63 37.24,32.16 v36.22,32.16
N$14
  Top 0.254: C11.2 35.57,34.33 35.97,33.94 35.97,33.43 36.22,33.17 36.87,33.17 U$1.8
N$15  (via drill 0.25)
  Top 0.254: v47.91,23.27 29.36,23.27 v18.95,33.68 | v18.95,38 18.95,40.79 v21.49,43.33
  Bottom 0.254: R21.1 49.24,24.6 v47.91,23.27 | v18.95,33.68 v18.95,38 | v21.49,43.33 23.78,45.62 29.59,45.62 U$18.4
N$16
  Top 0.254: C12.1 38.47,31.18 38,31.65 U$1.10
N$17
  Bottom 0.254: U$14.P$6 44.57,36.19 44.86,36.48 46.73,36.48 C1.1
N$18  (via drill 0.25 pad 0.25)
  Top 0.254: v41.05,27.08 41.05,28.6 v42.06,29.62
  Bottom 0.254: U$13.12 41.08,27.05 v41.05,27.08 | v42.06,29.62 42.67,29.62 R8.2
N$19
  Bottom 0.254: R9.2 44.21,27 U$13.14
N$20
  Bottom 0.254: U$13.16 43.9,24.54 R10.2
N$21
  Bottom 0.254: U$13.1 43.18,23.52 R11.2
N$23  (via drill 0.25 pad 0.25)
  Top 0.254: v46.89,29.36 47.91,29.36 48.67,28.6 v48.67,27.59
  Bottom 0.254: U$13.15 46.2,28.29 U$17.3 46.2,28.68 v46.89,29.36 | v48.67,27.59 48.67,26.64 R21.2
N$24
  Bottom 0.254: 37.88,27.18 R12.2 36.6,28.66 C14.1 35.05,30.33 35.03,30.33 U$15.3 33.17,32.18 33.17,32.67 33.94,33.43 34.44,33.43 34.82,33.05 U$15.1
N$25
  Bottom 0.254: U$19.P$2 35.03,47.81 U$18.1
N$26
  Bottom 0.254: U$15.5 32.7,34.16 R13.1 C15.2 27.68,39.17 R14.2
N$27
  Bottom 0.254: U$15.4 32,33.33 30.13,35.21 29.7,35.21 C17.1
N$28
  Bottom 0.254: C19.1 27.6,32.37 U$16.4
N$29
  Bottom 0.254: U$16.5 29.8,31.31 R15.1 C20.2 26.27,34.53 R16.2 24.63,36.32 R17.1
N$30
  Bottom 0.254: U$20.2 36.37,18.61 R24.2 | R24.2 | R24.2 C22.1
N$32
  Bottom 0.254: R19.1 | R19.1 D6.A
N$33
  Bottom 0.254: R20.1 17.07,43.33 D7.A
N$34
  Bottom 0.254: U$20.3 39.02,19.42 R26.1
N$35  (via drill 0.25 pad 0.25)
  Top 0.254: v46.38,41.05 48.41,41.05 v48.92,41.56
  Bottom 0.254: U$14.P$4 43.8,36.95 45.37,38.51 45.37,40.03 v46.38,41.05 | v48.92,41.56 48.92,47.05 JP2.D+1
N$36
  Bottom 0.254: U$14.P$5 47.91,40.29 47.91,46.96 JP2.D-1
PA11  (via drill 0.25 pad 0.25)
  Top 0.254: v41.81,30.63 47.44,30.63 U$11.12
  Bottom 0.254: U$14.P$23 39.81,36.19 39.52,36.48 38.51,36.48 37.75,35.71 37.75,34.7 v41.81,30.63
RESET  (via drill 0.25 pad 0.25)
  Top 0.254: U$11.5 31.2,38.57 v33.68,41.05
  Bottom 0.254: v33.68,41.05 35.98,41.05 38.52,38.51 41.05,38.51 41.6,37.96 U$14.P$28
SCL/PB6  (1 unrouted)
  Top 0.254: U1.23 35.46,42.32 34.95,41.81 34.95,41.05 31.4,37.49 27.33,37.49 25.5,35.66 | U1.23
SDA/PB7
  Top 0.254: U1.24 35.92,41 31.4,36.48 28.59,36.48 U$11.6
SYSOFF  (via drill 0.25 pad 0.25)
  Top 0.254: v30.89,42.83 30.38,43.33 v30.38,44.6
  Bottom 0.254: R23.2 34.66,42.53 33.94,41.81 32.92,41.81 31.9,42.83 v30.89,42.83 | v30.38,44.6 31.14,45.37 32.05,45.37 U$18.3
UART_RX  (via drill 0.25 pad 0.25)
  Top 0.254: U$11.3 28.86,42.57 v29.36,42.06
  Bottom 0.254: v29.36,42.06 31.65,42.06 34.44,39.27 36.98,39.27 38.25,38 40.16,38 U$14.P$26
UART_TX  (via drill 0.25 pad 0.25)
  Top 0.254: U$11.2 28.5,44.2 v31.4,41.3
  Bottom 0.254: v31.4,41.3 33.94,38.76 36.48,38.76 37.75,37.49 39.96,37.49 U$14.P$25
VBUS  (via drill 0.25 pad 0.25)
  Top 0.254: v46.38,39.78 45.87,39.27 45.87,38.25 46.89,37.24 46.89,36.48 v45.87,35.46 | v44.35,50.7 45.11,50.7 47.14,52.73 47.14,54.84 U$22.1 | v42.32,26.57 v45.37,29.62 | v47.65,31.9 48.41,31.9 48.92,31.4 v49.18,31.4
  Bottom 0.254: v46.38,39.78 47.14,40.54 47.14,46.89 48.98,48.72 JP2.VBUS1 46.1,48.95 v44.35,50.7 43.5,51.55 C24.1 | U$22.1 46.46,54.9 C23.1 | U$13.13 42.11,26.36 v42.32,26.57 | v45.37,29.62 45.84,29.62 U$17.1 | U$14.P$7 U$14.P$8 | U$14.P$8 46.37,34.71 46.89,34.19 46.89,30.92 U$17.1 | U$17.1 47.02,31.27 v47.65,31.9 | v49.18,31.4 49.68,31.4 49.94,31.65 49.94,31.85 R22.2 | v45.87,35.46 45.62,35.46 U$14.P$8
VCCA  (via drill 0.25, 0.25 pad 0.25)
  Top 0.254: U$1.2 38.51,35.71 38.25,35.97 37.75,35.97 37.5,35.73 U$1.4 37.49,35.29 37.49,34.7 39,33.19 U$1.13 40.27,33.19 41.05,32.41 v44.35,32.41 | v45.87,33.94 45.87,34.44 45.62,34.7 R7.2 R6.2 43.84,37.1 43.84,40.03 43.73,40.14 43.73,40.68 45.11,42.06 45.11,47.27 C9.1 | C9.1 C7.1 C6.1 C5.1 32.52,51.32 v31.9,50.7 | U1.9 U1.8 40.79,42.32 | 40.79,42.32 | v40.29,45.87 40.79,45.87 41.3,45.37 41.3,45.11 41.05,44.86 39.6,44.86 U1.13 39.3,49.55 C9.1 | v29.87,49.43 29.87,48.67 25.81,44.6 25.81,43.84 25.55,43.59 24.28,43.59 23.52,42.83 23.52,41.81 24.03,41.3 27.08,41.3 27.59,41.81 v28.35,41.81 | 40.79,42.32 41.05,42.32 41.3,42.06 41.3,41.56 v40.79,41.05
  Bottom 0.254: v44.35,32.41 v45.87,33.94 | U$15.6 33.37,35.33 R13.2 | R13.2 | R13.2 C15.1 29.62,39.08 | v40.79,41.05 39.52,41.05 38.51,42.06 38.51,44.1 v40.29,45.87 | v31.9,50.7 31.14,50.7 v29.87,49.43 | v28.35,41.81 28.6,41.81 29.62,40.79 29.62,39.08 | C16.1 27.98,40.72 29.62,39.08
VCCD  (via drill 0.25)
  Top 0.254: U$11.1 25.5,45.82 v24.03,44.35
  Bottom 0.254: R20.2 R19.2 20.66,42.29 C21.1 21.88,41.07 R18.2 | v24.03,44.35 24.03,41.67 R18.2 | R18.2 C20.1 R15.2 30.67,32.27 U$16.6 | R18.2
VCOM
  Bottom 0.254: R12.1 U$13.10 U$13.11 | R12.1 39,26.11 C18.1 37.65,25.3 36.22,25.3 | C10.1 38.98,26.29 R12.1 | C10.1 | 36.22,25.3 35.46,24.54 35.46,23.27 37.49,21.24 37.49,19.46 37.97,18.98 U$20.1 37.97,17.17 R25.2 36.89,15.69 C13.1 | U$16.3 30.99,29.01 31.65,28.35 32.41,28.35 32.92,28.86 32.92,29.73 U$16.1 33.2,30.35 36.22,27.33 36.22,25.3